# Altium schematic sheet 4-Channel-Relay-Driver-Module-Circuit_2024-05-24.schdoc
size 304 x 191 mm
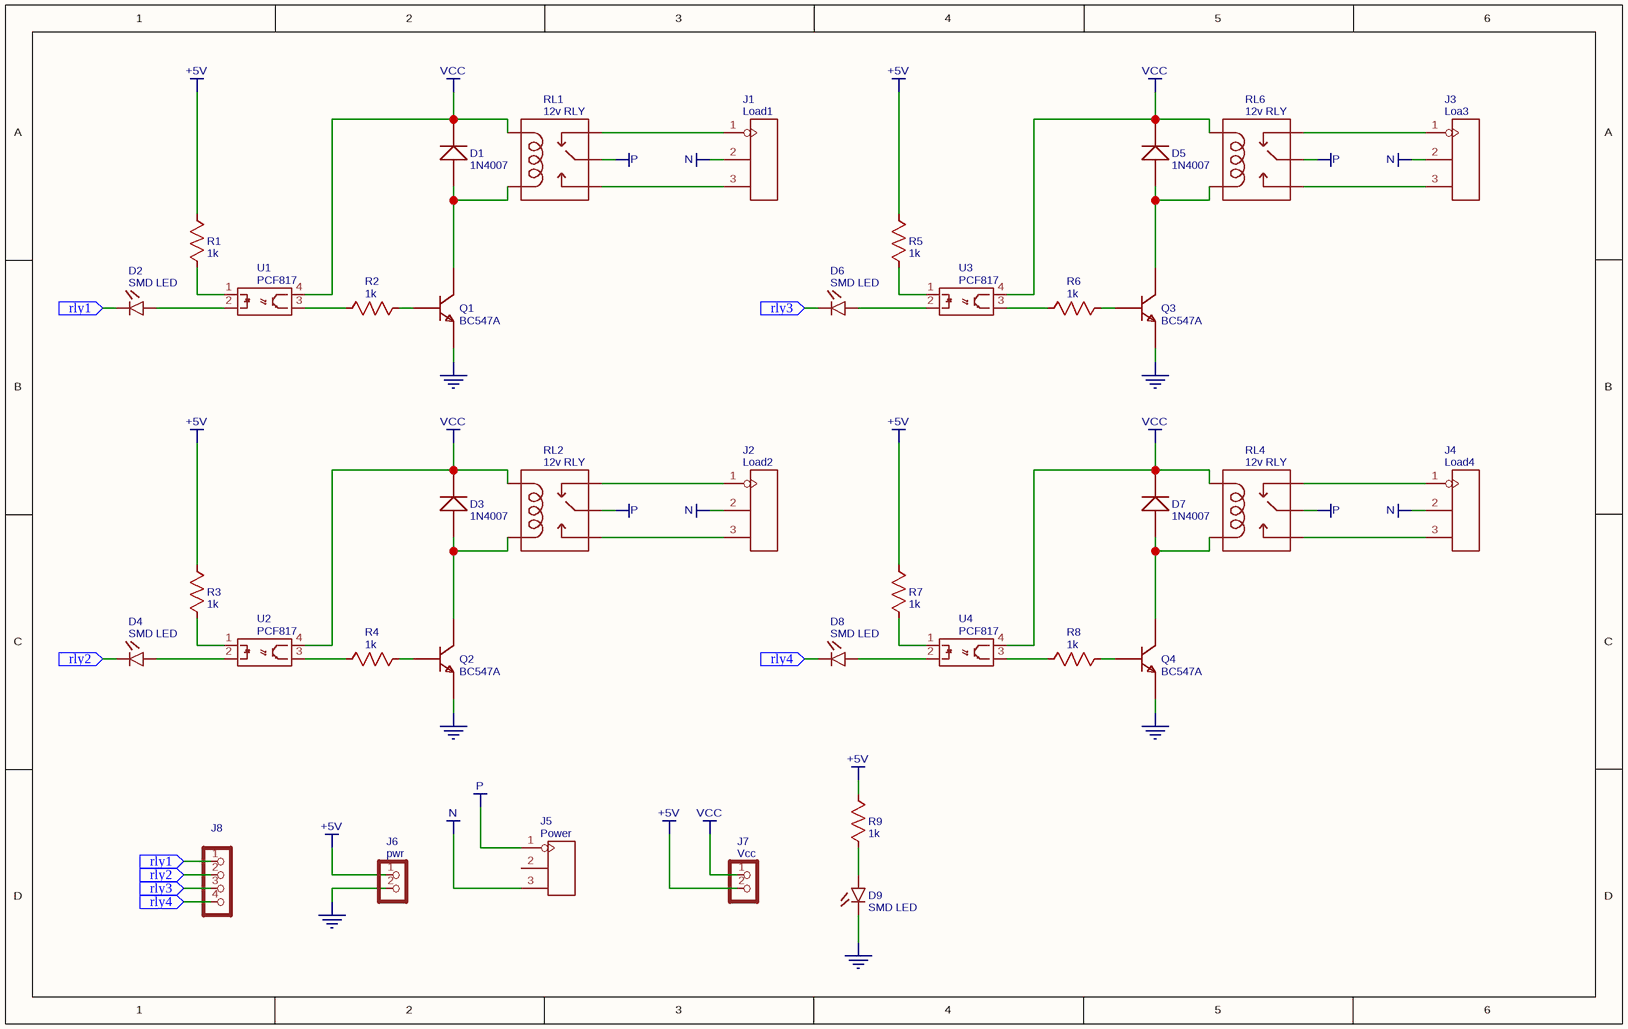
[diagram p0: 4-Channel-Relay-Driver-Module-Circuit_2024-05-24.schdoc]

## Parts
D1  1N4007  [DO-41]
D2  SMD LED  [1206 LED]
D3  1N4007  [DO-41]
D4  SMD LED  [1206 LED]
D5  1N4007  [DO-41]
D6  SMD LED  [1206 LED]
D7  1N4007  [DO-41]
D8  SMD LED  [1206 LED]
D9  SMD LED  [1206 LED]
J1  Load1  [H3-5.0-15.5X8.0MM]
J2  Load2  [H3-5.0-15.5X8.0MM]
J3  Loa3  [H3-5.0-15.5X8.0MM]
J4  Load4  [H3-5.0-15.5X8.0MM]
J5  Power  [H3-5.0-15.5X8.0MM]
J6  pwr  [M1X2]
J7  Vcc  [M1X2]
J8  +5v  [M1X4]  (value not drawn)
Q1  BC547A  [TO92-INLINE]
Q2  BC547A  [TO92-INLINE]
Q3  BC547A  [TO92-INLINE]
Q4  BC547A  [TO92-INLINE]
R1  1k  [AXIAL-0.3]
R2  1k  [AXIAL-0.3]
R3  1k  [AXIAL-0.3]
R4  1k  [AXIAL-0.3]
R5  1k  [AXIAL-0.3]
R6  1k  [AXIAL-0.3]
R7  1k  [AXIAL-0.3]
R8  1k  [AXIAL-0.3]
R9  1k  [AXIAL-0.3]
RL1  12v RLY  [OMRON_G5LE_SPDT_RELAY]
RL2  12v RLY  [OMRON_G5LE_SPDT_RELAY]
RL4  12v RLY  [OMRON_G5LE_SPDT_RELAY]
RL6  12v RLY  [OMRON_G5LE_SPDT_RELAY]
U1  PCF817  [DIP4]
U2  PCF817  [DIP4]
U3  PCF817  [DIP4]
U4  PCF817  [DIP4]

## Ports
rly1 (in), rly2 (in), rly3 (in), rly4 (in)

## Nets
+5V: J6.1 J7.2 R1.2 R3.2 R5.2 R7.2 R9.2
GND: D9.3(CATHODE) J6.2 Q1.3(E) Q2.3(E) Q3.3(E) Q4.3(E)
N: J1.2(P$2) J2.2(P$2) J3.2(P$2) J4.2(P$2) J5.3(P$3)
P: J5.1(P$1) RL1.1(MAIN) RL2.1(MAIN) RL4.1(MAIN) RL6.1(MAIN)
VCC: D1.2(K) D3.2(K) D5.2(K) D7.2(K) J7.1 RL1.2(COIL2) RL2.2(COIL2) RL4.2(COIL2) RL6.2(COIL2) U1.4 U2.4 U3.4 U4.4
rly1: D2.3(CATHODE) J8.1 ; port rly1
rly2: D4.3(CATHODE) J8.2 ; port rly2
rly3: D6.3(CATHODE) J8.3 ; port rly3
rly4: D8.3(CATHODE) J8.4 ; port rly4
NetD1_1: D1.1(A) Q1.1(C) RL1.5(COIL1)
NetD2_1: D2.1(ANODE) U1.2
NetD3_1: D3.1(A) Q2.1(C) RL2.5(COIL1)
NetD4_1: D4.1(ANODE) U2.2
NetD5_1: D5.1(A) Q3.1(C) RL6.5(COIL1)
NetD6_1: D6.1(ANODE) U3.2
NetD7_1: D7.1(A) Q4.1(C) RL4.5(COIL1)
NetD8_1: D8.1(ANODE) U4.2
NetD9_1: D9.1(ANODE) R9.1
NetJ1_1: J1.1(P$1) RL1.4(NC)
NetJ1_3: J1.3(P$3) RL1.3(NO)
NetJ2_1: J2.1(P$1) RL2.4(NC)
NetJ2_3: J2.3(P$3) RL2.3(NO)
NetJ3_1: J3.1(P$1) RL6.4(NC)
NetJ3_3: J3.3(P$3) RL6.3(NO)
NetJ4_1: J4.1(P$1) RL4.4(NC)
NetJ4_3: J4.3(P$3) RL4.3(NO)
NetQ1_2: Q1.2(B) R2.1
NetQ2_2: Q2.2(B) R4.1
NetQ3_2: Q3.2(B) R6.1
NetQ4_2: Q4.2(B) R8.1
NetR1_1: R1.1 U1.1
NetR2_2: R2.2 U1.3
NetR3_1: R3.1 U2.1
NetR4_2: R4.2 U2.3
NetR5_1: R5.1 U3.1
NetR6_2: R6.2 U3.3
NetR7_1: R7.1 U4.1
NetR8_2: R8.2 U4.3

Not connected (* = marked no-connect by the designer): J5 2(P$2)

## Library data of the parts
D1 D3 D5 D7 = 1N4007: catid: 20; description: 1.0 Ampere General Purpose Rectifier; Manufacturer Part: ?; spicePre: D
D2 D4 D6 D8 D9 = SMD LED: catid: 20; sourceId: A0UO69FXf; timeStamp: 1476010782; Manufacturer Part: ?; spicePre: U
J1 = Load1: catid: 20; description: Screw Terminal; sourceId: meqoljhDd; Supplier: SeeedStudio; Manufacturer Part: ?; timeStamp: 1468940954; spicePre: J; Supplier Part: 320110029
J2 = Load2: catid: 20; description: Screw Terminal; sourceId: meqoljhDd; Supplier: SeeedStudio; Manufacturer Part: ?; timeStamp: 1468940954; spicePre: J; Supplier Part: 320110029
J3 = Loa3: catid: 20; description: Screw Terminal; sourceId: meqoljhDd; Supplier: SeeedStudio; Manufacturer Part: ?; timeStamp: 1468940954; spicePre: J; Supplier Part: 320110029
J4 = Load4: catid: 20; description: Screw Terminal; sourceId: meqoljhDd; Supplier: SeeedStudio; Manufacturer Part: ?; timeStamp: 1468940954; spicePre: J; Supplier Part: 320110029
J5 = Power: catid: 20; description: Screw Terminal; Manufacturer Part: ?; spicePre: J
J6 = pwr: catid: 20; Contributor: DangerousPrototype; Manufacturer Part: ?; spicePre: J
J7 = Vcc: catid: 20; Contributor: DangerousPrototype; Manufacturer Part: ?; spicePre: J
J8 = +5v: catid: 20; Contributor: DangerousPrototype; Manufacturer Part: ?; spicePre: J
Q1-Q4 = BC547A: catid: 20; description: Amplifier Transistor NPN Silicon; Manufacturer Part: ?; spicePre: Q
R1-R9 = 1k: nameAlias: Value(Ω); Manufacturer Part: ?; spicePre: R; spiceSymbolName: Resistor
RL1 RL2 RL4 RL6 = 12v RLY: catid: 20; sourceId: Wgs2ZXjTR; timeStamp: 1461181445; Manufacturer Part: ?; spicePre: R
U1-U4 = PCF817: catid: 20; Contributor: KiCad; Manufacturer Part: ?; spicePre: U